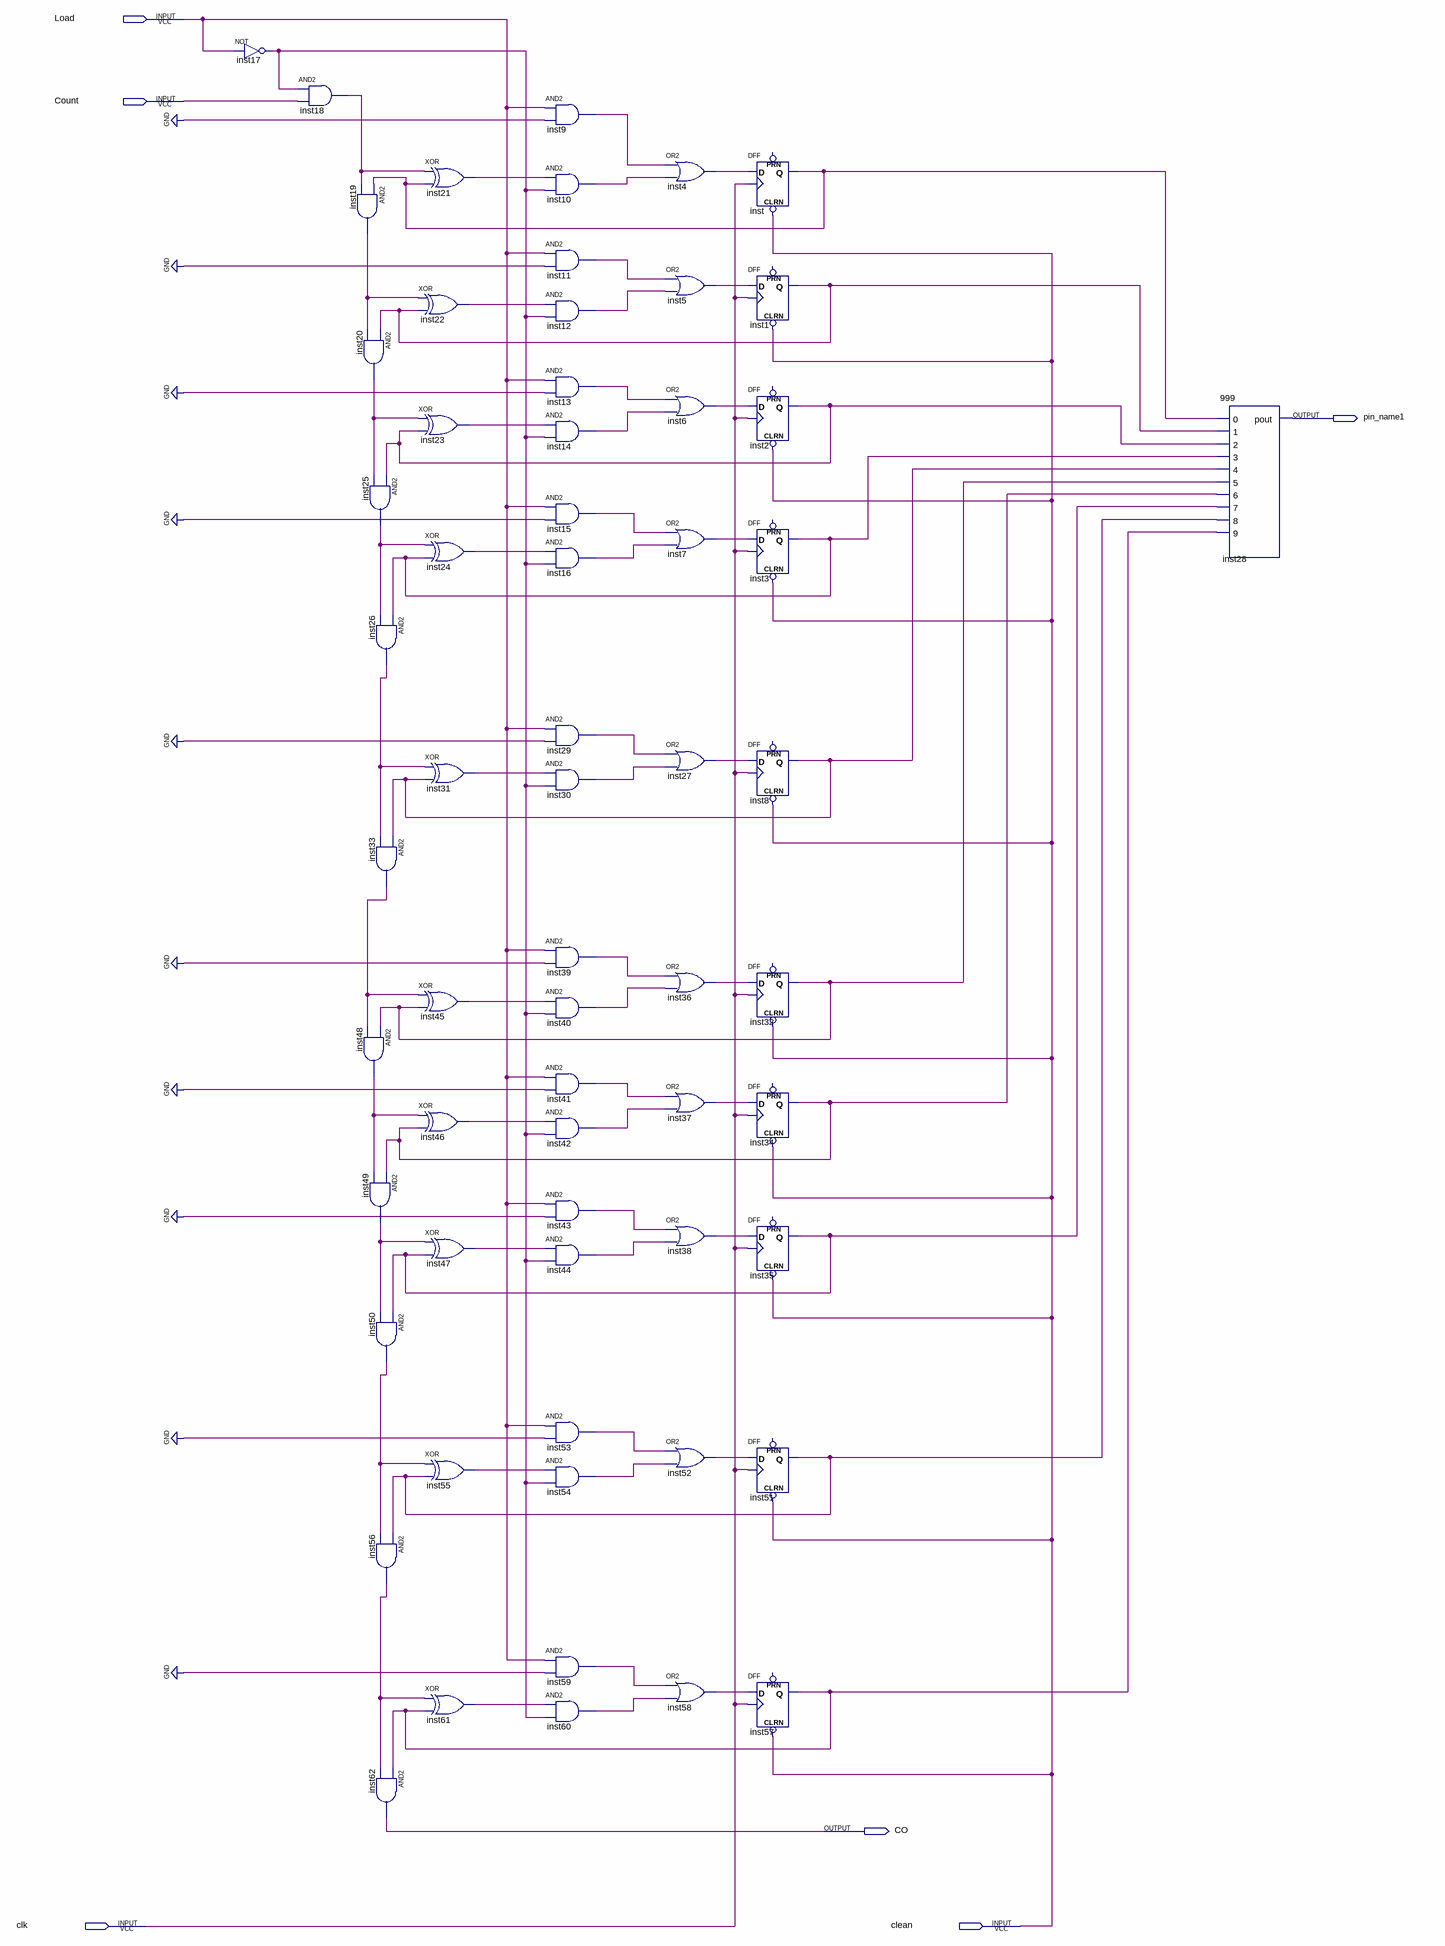
[diagram p0: schematic sheet]
// Quartus schematic pulser.bdf as structural Verilog: 63 symbols, 6 pins
module pulser (
  input  Load,
  input  Count,
  input  clk,
  input  clean,
  output pin_name1,
  output CO
);

  wire inst1_q, inst2_q, inst3_q, inst4_out, inst5_out, inst6_out, inst7_out, inst8_q, inst9_out, inst10_out,
       inst11_out, inst12_out, inst13_out, inst14_out, inst15_out, inst16_out, inst17_out, inst18_out,
       inst19_out, inst20_out, inst21_out, inst22_out, inst23_out, inst24_out, inst25_out, inst26_out,
       inst27_out, inst29_out, inst30_out, inst31_out, inst32_q, inst33_out, inst34_q, inst35_q, inst36_out,
       inst37_out, inst38_out, inst39_out, inst40_out, inst41_out, inst42_out, inst43_out, inst44_out,
       inst45_out, inst46_out, inst47_out, inst48_out, inst49_out, inst50_out, inst51_q, inst52_out,
       inst53_out, inst54_out, inst55_out, inst56_out, inst57_q, inst58_out, inst59_out, inst60_out,
       inst61_out, inst_q;

  not inst17 (inst17_out, Load);
  and inst18 (inst18_out, inst17_out, Count);
  and inst19 (inst19_out, inst_q, inst18_out);
  and inst20 (inst20_out, inst1_q, inst19_out);
  and inst48 (inst48_out, inst32_q, inst33_out);
  and inst25 (inst25_out, inst2_q, inst20_out);
  and inst26 (inst26_out, inst3_q, inst25_out);
  and inst33 (inst33_out, inst8_q, inst26_out);
  and inst49 (inst49_out, inst34_q, inst48_out);
  and inst50 (inst50_out, inst35_q, inst49_out);
  and inst56 (inst56_out, inst51_q, inst50_out);
  and inst62 (CO, inst57_q, inst56_out);
  xor inst21 (inst21_out, inst18_out, inst_q);
  xor inst22 (inst22_out, inst19_out, inst1_q);
  xor inst23 (inst23_out, inst20_out, inst2_q);
  xor inst24 (inst24_out, inst25_out, inst3_q);
  xor inst31 (inst31_out, inst26_out, inst8_q);
  xor inst45 (inst45_out, inst33_out, inst32_q);
  xor inst46 (inst46_out, inst48_out, inst34_q);
  xor inst47 (inst47_out, inst49_out, inst35_q);
  xor inst55 (inst55_out, inst50_out, inst51_q);
  xor inst61 (inst61_out, inst56_out, inst57_q);
  and inst9 (inst9_out, Load, 1'b0);
  and inst10 (inst10_out, inst21_out, inst17_out);
  and inst11 (inst11_out, Load, 1'b0);
  and inst12 (inst12_out, inst22_out, inst17_out);
  and inst13 (inst13_out, Load, 1'b0);
  and inst14 (inst14_out, inst23_out, inst17_out);
  and inst15 (inst15_out, Load, 1'b0);
  and inst16 (inst16_out, inst24_out, inst17_out);
  and inst29 (inst29_out, Load, 1'b0);
  and inst30 (inst30_out, inst31_out, inst17_out);
  and inst39 (inst39_out, Load, 1'b0);
  and inst40 (inst40_out, inst45_out, inst17_out);
  and inst41 (inst41_out, Load, 1'b0);
  and inst42 (inst42_out, inst46_out, inst17_out);
  and inst43 (inst43_out, Load, 1'b0);
  and inst44 (inst44_out, inst47_out, inst17_out);
  and inst53 (inst53_out, Load, 1'b0);
  and inst54 (inst54_out, inst55_out, inst17_out);
  and inst59 (inst59_out, Load, 1'b0);
  and inst60 (inst60_out, inst61_out, inst17_out);
  or inst4 (inst4_out, inst9_out, inst10_out);
  or inst5 (inst5_out, inst11_out, inst12_out);
  or inst6 (inst6_out, inst13_out, inst14_out);
  or inst7 (inst7_out, inst15_out, inst16_out);
  or inst27 (inst27_out, inst29_out, inst30_out);
  or inst36 (inst36_out, inst39_out, inst40_out);
  or inst37 (inst37_out, inst41_out, inst42_out);
  or inst38 (inst38_out, inst43_out, inst44_out);
  or inst52 (inst52_out, inst53_out, inst54_out);
  or inst58 (inst58_out, inst59_out, inst60_out);
  DFF inst (.CLRN(clean), .CLK(clk), .D(inst4_out), .Q(inst_q));  // open: PRN
  DFF inst1 (.CLRN(clean), .CLK(clk), .D(inst5_out), .Q(inst1_q));  // open: PRN
  DFF inst2 (.CLRN(clean), .CLK(clk), .D(inst6_out), .Q(inst2_q));  // open: PRN
  DFF inst3 (.CLRN(clean), .CLK(clk), .D(inst7_out), .Q(inst3_q));  // open: PRN
  DFF inst8 (.CLRN(clean), .CLK(clk), .D(inst27_out), .Q(inst8_q));  // open: PRN
  DFF inst32 (.CLRN(clean), .CLK(clk), .D(inst36_out), .Q(inst32_q));  // open: PRN
  DFF inst34 (.CLRN(clean), .CLK(clk), .D(inst37_out), .Q(inst34_q));  // open: PRN
  DFF inst35 (.CLRN(clean), .CLK(clk), .D(inst38_out), .Q(inst35_q));  // open: PRN
  DFF inst51 (.CLRN(clean), .CLK(clk), .D(inst52_out), .Q(inst51_q));  // open: PRN
  DFF inst57 (.CLRN(clean), .CLK(clk), .D(inst58_out), .Q(inst57_q));  // open: PRN
  \999  inst28 (
    .\0 (inst_q), .\1 (inst1_q), .\2 (inst2_q), .\3 (inst3_q), .\4 (inst8_q), .\5 (inst32_q), .\6 (inst34_q),
    .\7 (inst35_q), .\8 (inst51_q), .\9 (inst57_q), .pout(pin_name1));
endmodule
